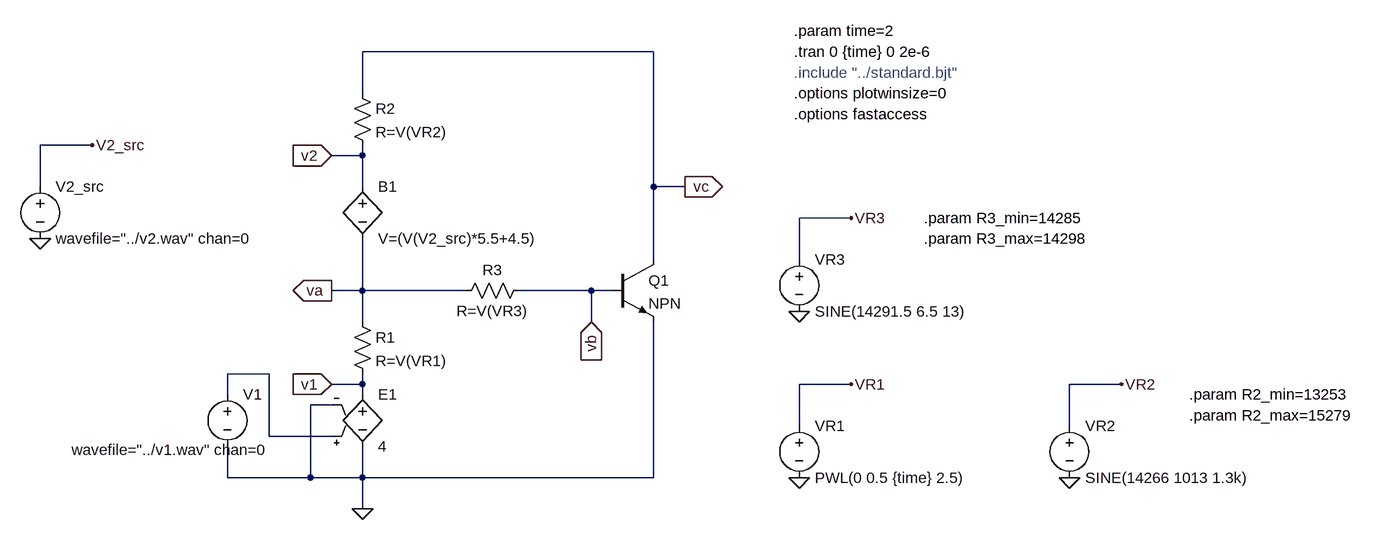
[diagram p0: schematic two_port_training_circuit.asc]
two_port_training_circuit.asc, the LTspice schematic file:
Version 4
SHEET 1 1576 680
WIRE 352 -128 -96 -128
WIRE -96 -64 -96 -128
WIRE -512 16 -592 16
WIRE -96 32 -96 16
WIRE -96 32 -144 32
WIRE -592 80 -592 16
WIRE -96 80 -96 32
WIRE 352 80 352 -128
WIRE 400 80 352 80
WIRE 656 128 576 128
WIRE 352 192 352 80
WIRE 576 192 576 128
WIRE -96 240 -96 160
WIRE -96 240 -144 240
WIRE 64 240 -96 240
WIRE 256 240 144 240
WIRE 288 240 256 240
WIRE -96 288 -96 240
WIRE 256 288 256 240
WIRE -240 368 -304 368
WIRE -96 384 -96 368
WIRE -96 384 -144 384
WIRE 656 384 576 384
WIRE 1072 384 992 384
WIRE -304 400 -304 368
WIRE -96 400 -96 384
WIRE -144 416 -176 416
WIRE 576 448 576 384
WIRE 992 448 992 384
WIRE -240 464 -240 368
WIRE -144 464 -240 464
WIRE -304 528 -304 480
WIRE -176 528 -176 416
WIRE -176 528 -304 528
WIRE -96 528 -96 480
WIRE -96 528 -176 528
WIRE 352 528 352 288
WIRE 352 528 -96 528
WIRE -96 576 -96 528
FLAG -96 576 0
FLAG -144 32 v2
IOPIN -144 32 In
FLAG -144 384 v1
IOPIN -144 384 In
FLAG 400 80 vc
IOPIN 400 80 Out
FLAG 256 288 vb
IOPIN 256 288 In
FLAG -144 240 va
IOPIN -144 240 Out
FLAG 576 272 0
FLAG 656 128 VR3
FLAG 576 528 0
FLAG 656 384 VR1
FLAG 992 528 0
FLAG 1072 384 VR2
FLAG -592 160 0
FLAG -512 16 V2_src
SYMBOL res -112 272 R0
SYMATTR InstName R1
SYMATTR Value R=V(VR1)
SYMBOL res -112 -80 R0
SYMATTR InstName R2
SYMATTR Value R=V(VR2)
SYMBOL res 160 224 R90
WINDOW 0 0 56 VBottom 2
WINDOW 3 32 56 VTop 2
SYMATTR InstName R3
SYMATTR Value R=V(VR3)
SYMBOL e2 -96 384 R0
SYMATTR InstName E1
SYMATTR Value 4
SYMBOL voltage -304 384 R0
WINDOW 3 -240 101 Left 2
WINDOW 123 0 0 Left 0
WINDOW 39 0 0 Left 0
SYMATTR Value wavefile="../v1.wav" chan=0
SYMATTR InstName V1
SYMBOL npn 288 192 R0
SYMATTR InstName Q1
SYMBOL voltage 576 176 R0
WINDOW 123 0 0 Left 0
WINDOW 39 0 0 Left 0
SYMATTR InstName VR3
SYMATTR Value SINE(14291.5 6.5 13)
SYMBOL voltage 576 432 R0
WINDOW 123 0 0 Left 0
WINDOW 39 0 0 Left 0
SYMATTR InstName VR1
SYMATTR Value PWL(0 0.5 {time} 2.5)
SYMBOL voltage 992 432 R0
WINDOW 123 0 0 Left 0
WINDOW 39 0 0 Left 0
SYMATTR InstName VR2
SYMATTR Value SINE(14266 1013 1.3k)
SYMBOL voltage -592 64 R0
SYMATTR InstName V2_src
SYMATTR Value wavefile="../v2.wav" chan=0
SYMBOL bv -96 64 R0
SYMATTR InstName B1
SYMATTR Value V=(V(V2_src)*5.5+4.5)
TEXT 568 -128 Left 2 !.tran 0 {time} 0 2e-6
TEXT 568 -96 Left 2 ;.include "../standard.bjt"
TEXT 568 -64 Left 2 !.options plotwinsize=0
TEXT 568 -32 Left 2 !.options fastaccess
TEXT 568 -160 Left 2 !.param time=2
TEXT 768 128 Left 2 !.param R3_min=14285
TEXT 768 160 Left 2 !.param R3_max=14298
TEXT 1176 432 Left 2 !.param R2_max=15279
TEXT 1176 400 Left 2 !.param R2_min=13253

The netlist it stands for:
* two_port_training_circuit.asc
R1 va v1 R=V(VR1)
R2 vc v2 R=V(VR2)
R3 vb va R=V(VR3)
E1 v1 0 N001 0 4
V1 N001 0 wavefile="../v1.wav" chan=0
Q1 vc vb 0 0 NPN
VR3 VR3 0 SINE(14291.5 6.5 13)
VR1 VR1 0 PWL(0 0.5 {time} 2.5)
VR2 VR2 0 SINE(14266 1013 1.3k)
V2_src V2_src 0 wavefile="../v2.wav" chan=0
B1 v2 va V=(V(V2_src)*5.5+4.5)
.model NPN NPN
.model PNP PNP
.lib standard.bjt
.tran 0 {time} 0 2e-6
* .include "../standard.bjt"
.options plotwinsize=0
.options fastaccess
.param time=2
.param R3_min=14285
.param R3_max=14298
.param R2_max=15279
.param R2_min=13253
.backanno
.end